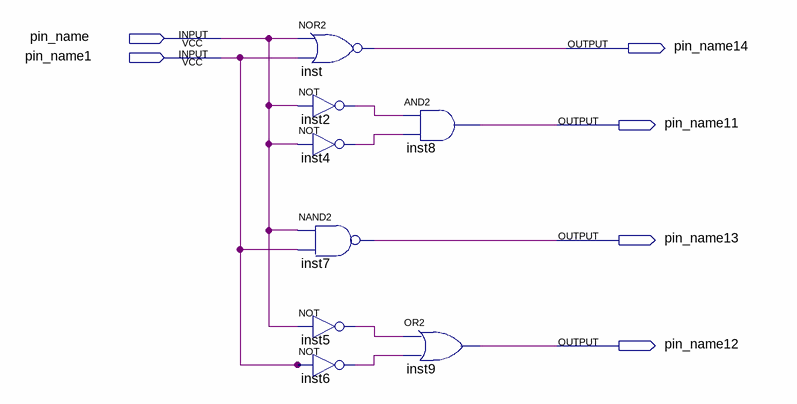
[diagram p0: schematic sheet]
// Quartus schematic 913037.bdf as structural Verilog: 8 symbols, 6 pins
module \913037  (
  input  pin_name,
  input  pin_name1,
  output pin_name14,
  output pin_name11,
  output pin_name13,
  output pin_name12
);

  wire inst2_out, inst4_out, inst5_out, inst6_out;

  nor inst (pin_name14, pin_name, pin_name1);
  not inst2 (inst2_out, pin_name);
  not inst4 (inst4_out, pin_name);
  nand inst7 (pin_name13, pin_name, pin_name1);
  not inst5 (inst5_out, pin_name);
  not inst6 (inst6_out, pin_name1);
  and inst8 (pin_name11, inst2_out, inst4_out);
  or inst9 (pin_name12, inst5_out, inst6_out);
endmodule
